# Altium schematic sheet ADS1115Arduino.SchDoc
size A4
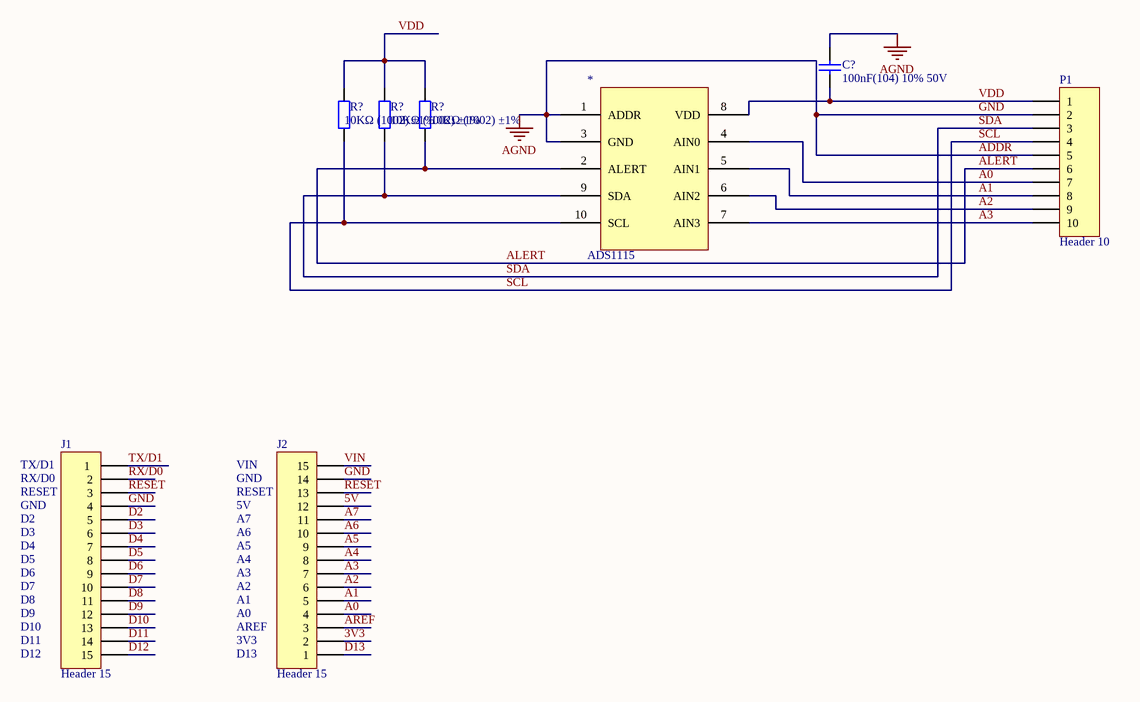
[diagram p0: ADS1115Arduino.SchDoc]

## Parts
(Parts that share a designator on the sheet are numbered #1, #2 ... from top to bottom, then left to right.)
*  ADS1115
C?  100nF(104) 10% 50V  [LC-0805_C]
J1  Header 15  [HDR1X15]
J2  Header 15  [HDR1X15]
P1  Header 10  [HDR1X10]
R?#1  10KΩ (1002) ±1%  [LC-0805_R]
R?#2  10KΩ (1002) ±1%  [LC-0805_R]
R?#3  10KΩ (1002) ±1%  [LC-0805_R]

## Nets
ADDR: *.1(ADDR) *.3(GND) C?.2 J1.4 J2.14 P1.ADDR(5) P1.GND(2)  [also labelled AGND, GND]
3V3: J2.2
5V: J2.12
A0: *.4(AIN0) J2.4 P1.A0(7)
A1: *.5(AIN1) J2.5 P1.A1(8)
A2: *.6(AIN2) J2.6 P1.A2(9)
A3: *.7(AIN3) J2.7 P1.A3(10)
A4: J2.8
A5: J2.9
A6: J2.10
A7: J2.11
ALERT: *.2(ALERT) P1.ALERT(6) R?#3.1
AREF: J2.3
D2: J1.5
D3: J1.6
D4: J1.7
D5: J1.8
D6: J1.9
D7: J1.10
D8: J1.11
D9: J1.12
D10: J1.13
D11: J1.14
D12: J1.15
D13: J2.1
RESET: J1.3 J2.13
RX/D0: J1.2
SCL: *.10(SCL) P1.SCL(4) R?#1.1
SDA: *.9(SDA) P1.SDA(3) R?#2.1
TX/D1: J1.1
VDD: *.8(VDD) C?.1 P1.VDD(1) R?#1.2 R?#2.2 R?#3.2
VIN: J2.15

## Notes on the sheet
- Labels drawn without touching a wire or pin: 3V3, 5V, A0, A1, A2, A3, A4, A5, A6, A7, AREF, D2, D3, D4, D5, D6, D7, D8, D9, D10, D11, D12, D13, GND, RESET, RX/D0, TX/D1, VIN

## Library data of the parts
C? = 0805 100nF(104) 10% 50V: 贴片电容; ComponentLink1Description: 供应商链接; ComponentLink1URL: http://www.szlcsc.com/product/details_50686.html; Package: 0805; Supplier: LC; SuppliersPartNumber: C49678
J1 J2 = Header 15: Header, 15-Pin; LatestRevisionDate: 17-Jul-2002; LatestRevisionNote: Re-released for DXP Platform.; Publisher: Altium Limited
P1 = Header 10: Header, 10-Pin; LatestRevisionDate: 17-Jul-2002; LatestRevisionNote: Re-released for DXP Platform.; Publisher: Altium Limited
R?#1-R?#3 = 0805 10KΩ (1002) 1%: 贴片电阻; ComponentLink1Description: 供应商链接; ComponentLink1URL: http://www.szlcsc.com/product/details_18102.html; Package: 0805; Supplier: LC; SuppliersPartNumber: C17414